# Altium schematic sheet Connect.SchDoc: Balance_Car 主控板外设部分
size A4; Date: 2017/3/23; Author: 卢晗; DrawnBy: 卢晗; Engineer: 卢晗; Revision: V1.0
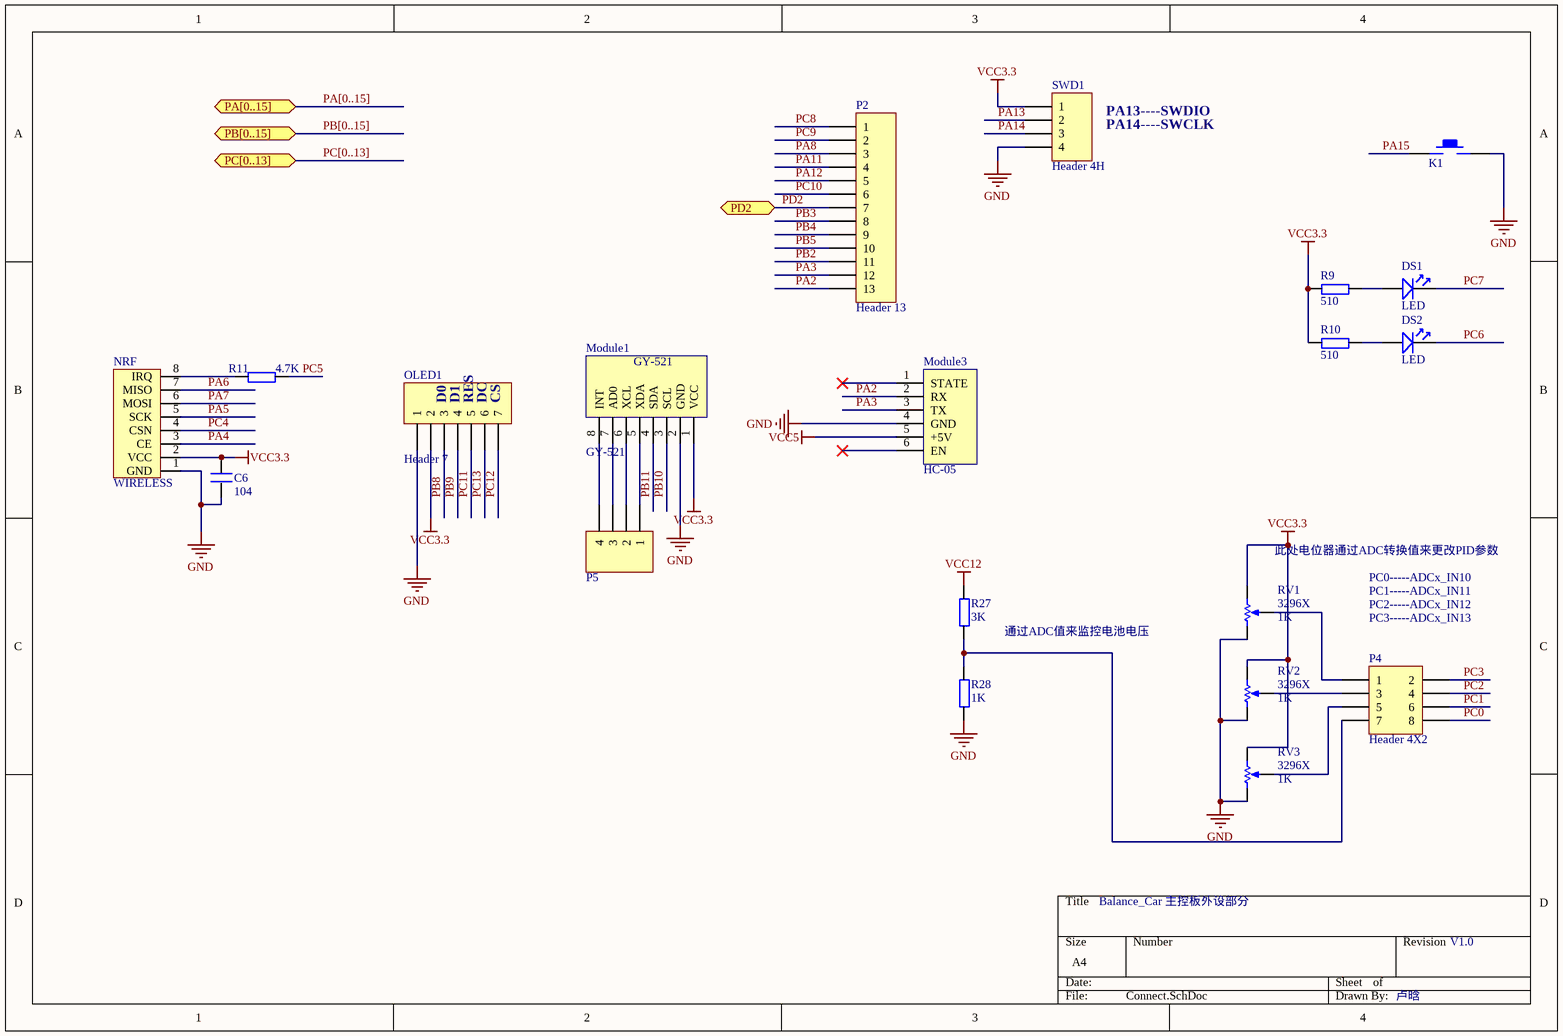
[diagram p0: Connect.SchDoc]

## Parts
C6  104  [0603C]
DS1  LED  [0603D-R]
DS2  LED  [0603D-R]
K1  KEY_M  [KEY_SOP3625_B]  (value not drawn)
Module1  GY-521  [GY-521]
Module3  HC-05  [HC-05]
NRF  WIRELESS  [NRF24L01]
OLED1  Header 7  [HDR1X7]
P2  Header 13  [HDR1X13]
P4  Header 4X2  [HDR2X4]
P5  Header 4  [HDR_1x4_2R54_V_M]  (value not drawn)
R9  510  [0603R]
R10  510  [0603R]
R11  4.7K  [0603R]
R27  3K  [0603R]
R28  1K  [0603R]
RV1  3296X  value 1K  [VR5-R]
RV2  3296X  value 1K  [VR5-R]
RV3  3296X  value 1K  [VR5-R]
SWD1  Header 4H  [HDR1X4H]

## Ports
PA[0..15] (bidir), PB[0..15] (bidir), PC[0..13] (bidir), PD2 (bidir)

## Nets
GND: C6.1 K1.2 Module1.2(GND) Module3.4(GND) NRF.1(GND) OLED1.1 R28.1 RV1.1(TOP) RV2.1(TOP) RV3.1(TOP) SWD1.4
VCC3.3: C6.2 Module1.1(VCC) NRF.2(VCC) OLED1.2 R9.1 R10.1 RV1.3(TAP) RV2.3(TAP) RV3.3(TAP) SWD1.1
VCC5: Module3.5(+5V)
VCC12: R27.2
PA2: Module3.2(RX) P2.13
PA3: Module3.3(TX) P2.12
PA4: NRF.3(CE)
PA5: NRF.5(SCK)
PA6: NRF.7(MISO)
PA7: NRF.6(MOSI)
PA8: P2.3
PA11: P2.4
PA12: P2.5
PA13: SWD1.2
PA14: SWD1.3
PA15: K1.1
PB2: P2.11
PB3: P2.8
PB4: P2.9
PB5: P2.10
PB8: OLED1.3
PB9: OLED1.4
PB10: Module1.3(SCL)
PB11: Module1.4(SDA)
PC0: P4.8
PC1: P4.6
PC2: P4.4
PC3: P4.2
PC4: NRF.4(CSN)
PC5: R11.2
PC6: DS2.2
PC7: DS1.2
PC8: P2.1
PC9: P2.2
PC10: P2.6
PC11: OLED1.5
PC12: OLED1.7
PC13: OLED1.6
PD2: P2.7 ; port PD2
NetDS1_1: DS1.1 R9.2
NetDS2_1: DS2.1 R10.2
NetModule1_5: Module1.5(XDA) P5.1
NetModule1_6: Module1.6(XCL) P5.2
NetModule1_7: Module1.7(AD0) P5.3
NetModule1_8: Module1.8(INT) P5.4
NetNRF_8: NRF.8(IRQ) R11.1
NetP4_1: P4.1 RV1.2(BOT)
NetP4_3: P4.3 RV2.2(BOT)
NetP4_5: P4.5 RV3.2(BOT)
NetP4_7: P4.7 R27.1 R28.2

Not connected (* = marked no-connect by the designer): Module3 1(STATE)* 6(EN)*

## Buses and harness runs
bus PA[0..15] = port PA[0..15]
bus PB[0..15] = port PB[0..15]
bus PC[0..13] = port PC[0..13]

## Notes on the sheet
- PA13----SWDIO
- PA14----SWCLK
- (near OLED1) D0
- (near OLED1) D1
- (near OLED1) RES
- (near OLED1) DC
- (near OLED1) CS
- (near RV1) 此处电位器通过ADC转换值来更改PID参数
- PC0-----ADCx_IN10
- 通过ADC值来监控电池电压
- PC1-----ADCx_IN11
- PC2-----ADCx_IN12
- PC3-----ADCx_IN13

## Library data of the parts
C6 = C
Module3 = HC-05: Bluetooth Module(HC-05)
NRF = NRF24L01
OLED1 = Header 7: Header, 7-Pin; LatestRevisionDate: 17-Jul-2002; LatestRevisionNote: Re-released for DXP Platform.; Publisher: Altium Limited
P2 = Header 13: Header, 13-Pin; LatestRevisionDate: 17-Jul-2002; LatestRevisionNote: Re-released for DXP Platform.; Publisher: Altium Limited
P4 = Header 4X2: Header, 4-Pin, Dual row; LatestRevisionDate: 17-Jul-2002; LatestRevisionNote: Re-released for DXP Platform.; Publisher: Altium Limited
P5 = Header 4: Header, 4-Pin, Single row; Revision: 17-Jul-2002: Re-released for DXP Platform.; Publisher: Altium Limited
R9-R11 R27 R28 = R
RV1-RV3 = RPot: Potentiometer; Sim Note: Enter the Resistance value and the set point into parameter fields.; Set Position: 0.5; Published: 8-Jun-2000; LatestRevisionDate: 17-Jul-2002; LatestRevisionNote: Re-released for DXP Platform.; PackageReference: VR5; Publisher: Altium Limited; PackageDescription: Variable Resistor, Thru-Hole; 3 Leads
SWD1 = Header 4H: Header, 4-Pin, Right Angle; LatestRevisionDate: 17-Jul-2002; LatestRevisionNote: Re-released for DXP Platform.; Publisher: Altium Limited